# EAGLE schematic Remote (EAGLE 9.5.0)
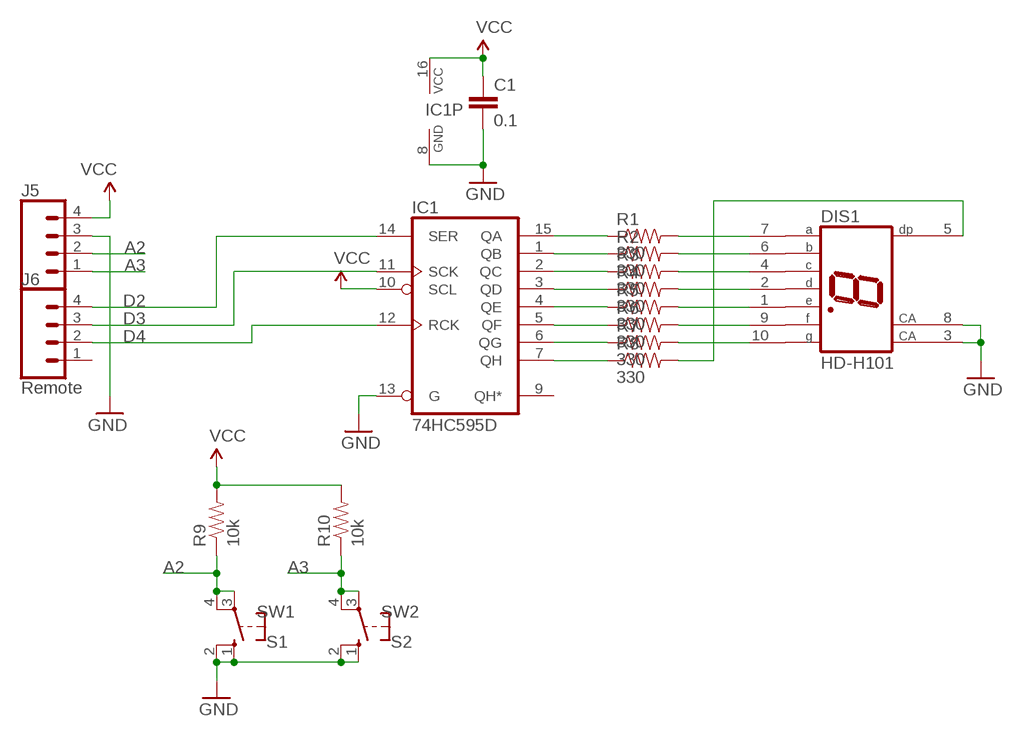
[diagram p0: schematic, sheet 1]

## Parts
C1  0.1  CAP0805  [0805]
DIS1  HD-H101  [HDSP-M]
IC1  74HC595D  [SO16]
J5  CONN_04JST-PTH  [JST-4-PTH]
J6  Remote  CONN_04JST-PTH  [JST-4-PTH]
R1  330  RESISTOR0805-RES  [0805]
R2  330  RESISTOR0805-RES  [0805]
R3  330  RESISTOR0805-RES  [0805]
R4  330  RESISTOR0805-RES  [0805]
R5  330  RESISTOR0805-RES  [0805]
R6  330  RESISTOR0805-RES  [0805]
R7  330  RESISTOR0805-RES  [0805]
R8  330  RESISTOR0805-RES  [0805]
R9  10k  RESISTOR0805-RES  [0805]
R10  10k  RESISTOR0805-RES  [0805]
S1  SW1  10-XX  [B3F-10XX]
S2  SW2  10-XX  [B3F-10XX]

## Nets
A2: J5.2 R9.1 S1.3(P) S1.4(P1)
A3: J5.1 R10.1 S2.3(P) S2.4(P1)
D2: IC1.14(SER) J6.4
D3: IC1.11(SCK) J6.3
D4: IC1.12(RCK) J6.2
GND: C1.2 DIS1.3(CA) DIS1.8(CA) IC1.8(GND) IC1.13(G) J5.3 S1.1(S) S1.2(S1) S2.1(S) S2.2(S1)
N$1: IC1.15(QA) R1.1
N$2: IC1.1(QB) R2.1
N$3: DIS1.5(DP) R8.2
N$4: IC1.2(QC) R3.1
N$5: IC1.3(QD) R4.1
N$6: IC1.4(QE) R5.1
N$7: IC1.5(QF) R6.1
N$8: IC1.6(QG) R7.1
N$9: IC1.7(QH) R8.1
N$12: DIS1.7(A) R1.2
N$13: DIS1.6(B) R2.2
N$14: DIS1.4(C) R3.2
N$15: DIS1.2(D) R4.2
N$16: DIS1.1(E) R5.2
N$17: DIS1.9(F) R6.2
N$18: DIS1.10(G) R7.2
VCC: C1.1 IC1.10(SCL) IC1.16(VCC) J5.4 R9.2 R10.2
Unconnected: IC1.9(QH*) J6.1

## Library data of the parts
C1 = SparkFun:CAP: Capacitor Standard 0603 ceramic capacitor, and 0.1" leaded capacitor.
DIS1 = display-hp:HD-H101: LED DISPLAY 1-character 7 segment, decimal point right; OC_FARNELL: unknown; OC_NEWARK: unknown
IC1 = 74xx-eu:74*595: 8-bit SHIFT REGISTER, output latch
J5 J6 = SparkFun-Connectors:CONN_04: Multi connection point. Often used as Generic Header-pin footprint for 0.1 inch spaced/style header connections On any of the 0.1 inch spaced packages, you can populate with these: Break Away Headers - Straight <https://www.sparkfun.com/products/116> (PRT-00116) Break Away Male Headers - Right Angle <https://www.sparkfun.com/products/553> (PRT-00553) Female Headers <https://www.sparkfun.com/products/115> (PRT-00115) Break Away Headers - Machine Pin <https://www.sparkfun.com/products/117> (PRT-00117) Break Away Female Headers - Swiss Machine Pin <https://www.sparkfun.com/products/743> (PRT-00743) For SCREWTERMINALS and SPRING TERMINALS visit here: Screw Terimnals on SparkFun.com <https://www.sparkfun.com/search/results?term=Screw+Terminals> (5mm/3.5mm/2.54mm spacing) This device is also useful as a general connection point to wire up your design to another part of your project. Our various solder wires solder well into these plated through hole pads. Hook-Up Wire - Assortment (Stranded, 22 AWG) <https://www.sparkfun.com/products/11375> (PRT-11375) Hook-Up Wire - Assortment (Solid Core, 22 AWG) <https://www.sparkfun.com/products/11367> (PRT-11367) View the entire wire category on our website here <https://www.sparkfun.com/categories/141> Special notes: Molex polarized connector foot print use with SKU : PRT-08231 with associated crimp pins and housings. 1MM SMD Version SKU: PRT-10208; PROD_ID: WIRE-13531; SF_ID: PRT-09916
R1-R10 = SparkFun-Resistors:RESISTOR: Resistor Basic schematic elements and footprints for 0603, 1206, and PTH resistors.
S1 S2 = switch-omron:10-XX: OMRON SWITCH; MPN: B3F-1000; OC_FARNELL: 176432; OC_NEWARK: 36M3542